# EAGLE design I2C-23017 (EAGLE 7.7.0)

## Sheet 1 of 2
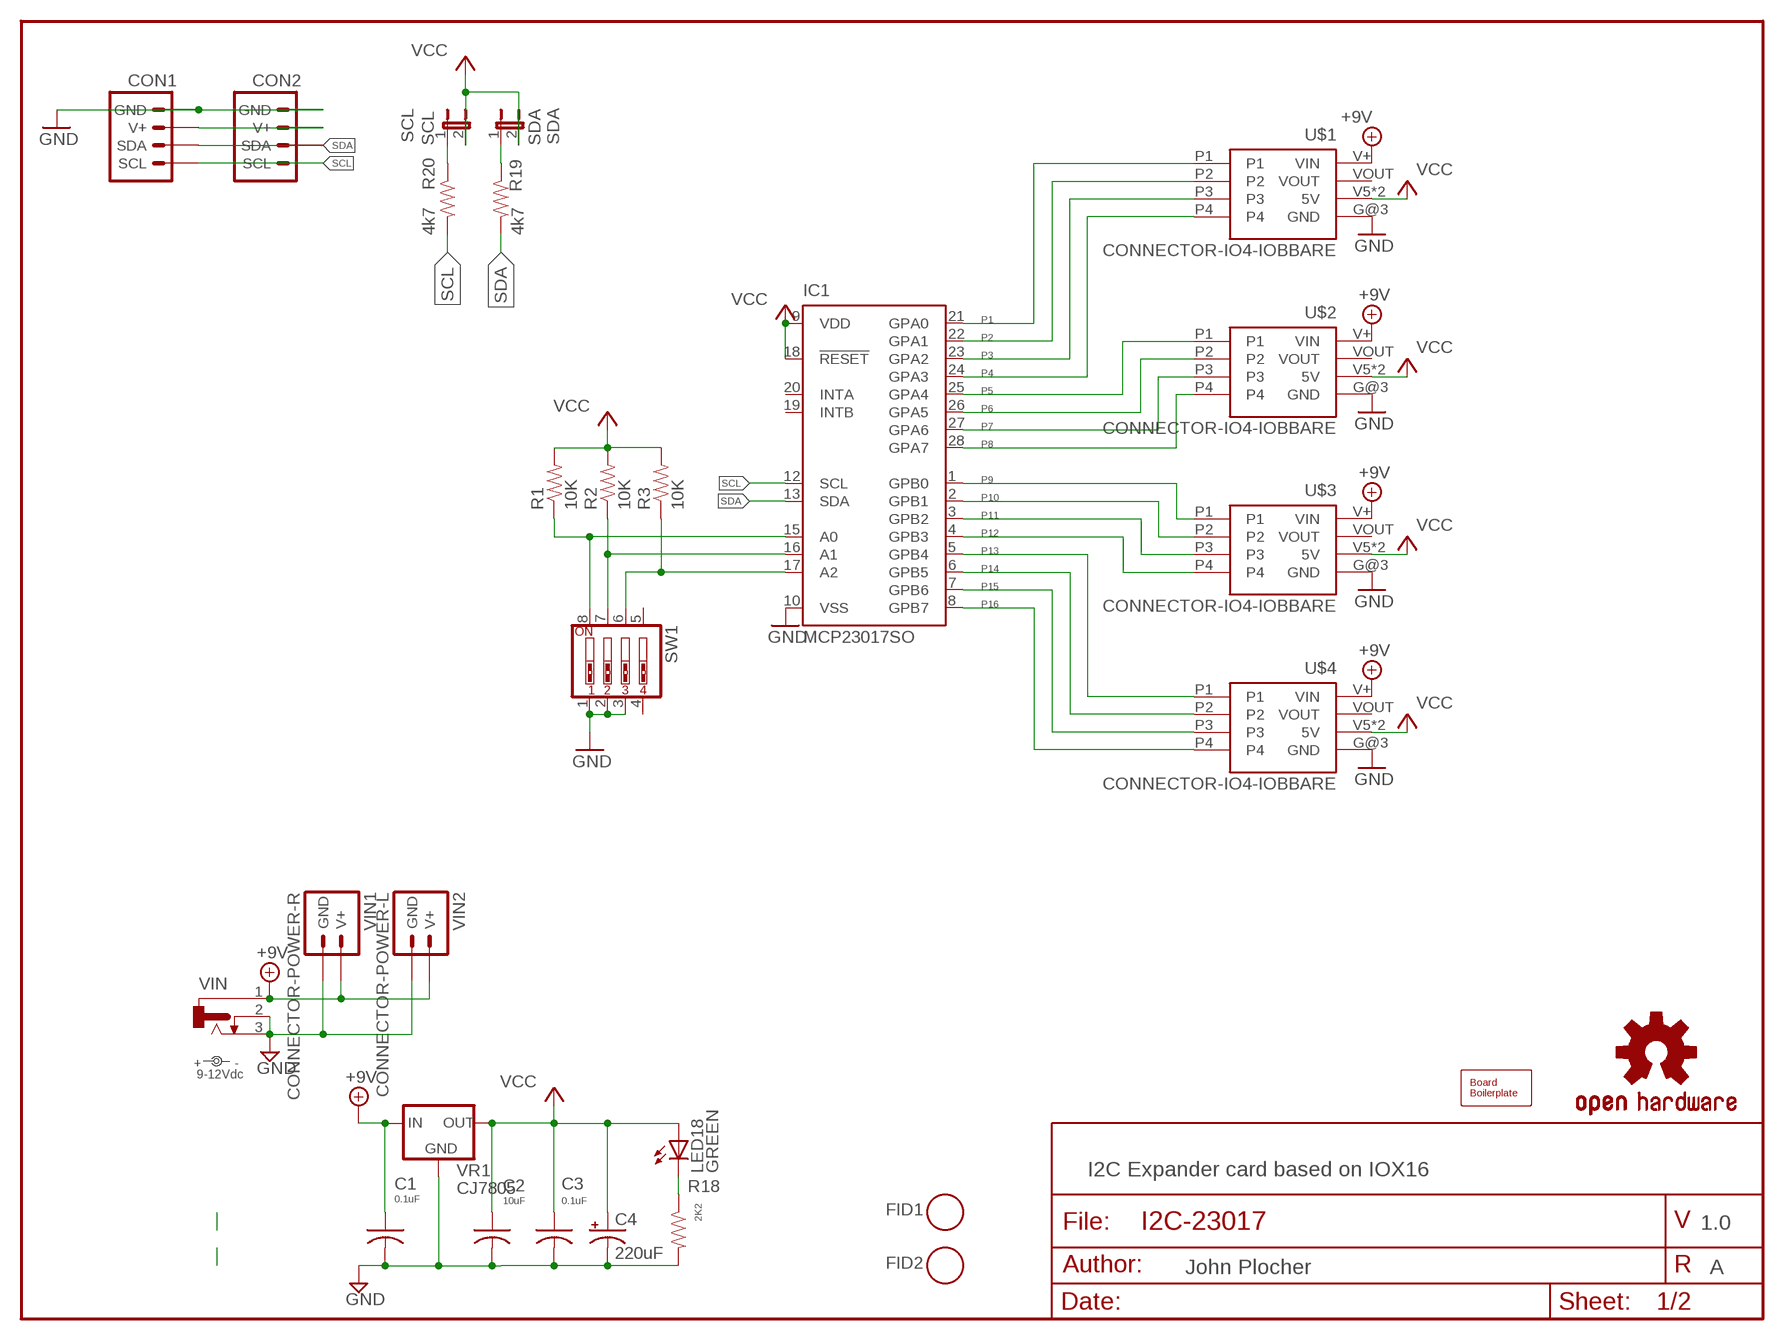
[diagram p0: schematic, sheet 1]

### Parts
BOARD1  BOARD80X100-IOB  [BOARD-DINRAIL-3.17IN-IOB]
C1  0.1uF  CAP0805  [0805-CAP]
C2  10uF  CAP0805  [0805-CAP]
C3  0.1uF  CAP0805  [0805-CAP]
C4  220uF  CAP-POL0810  [0810-CAP]
CON1  CONNECTOR-I2CLEFT  [I2C-L]
CON2  CONNECTOR-I2CLEFT  [I2C-L]
FID1  FIDUCIAL  [FIDUCIAL_1MM]
FID2  FIDUCIAL  [FIDUCIAL_1MM]
IC1  MCP23017SO  [SO28W]
LED18  GREEN  LED0603-LED  [0603-LED]
OSHW1  DOC-OSHW-LOGO-M  [OSHW-LOGO-M]
POWER  9-12Vdc  DOC-POWER_LABEL  [PWR_LABEL]
R1  10K  R0603-RES  [0603-RES]
R2  10K  R0603-RES  [0603-RES]
R3  10K  R0603-RES  [0603-RES]
R18  2K2  R0603-RES  [0603-RES]
R19  4k7  R0603-RES  [0603-RES]
R20  4k7  R0603-RES  [0603-RES]
SCL  SCL  JUMPER-2PTH_LOCK  [1X02_LOCK]
SDA  SDA  JUMPER-2PTH_LOCK  [1X02_LOCK]
SW1  SW_DIP-4  [EDG-04]
U$1  CONNECTOR-IO4-IOBBARE  [IO4-IOB]
U$2  CONNECTOR-IO4-IOBBARE  [IO4-IOB]
U$3  CONNECTOR-IO4-IOBBARE  [IO4-IOB]
U$4  CONNECTOR-IO4-IOBBARE  [IO4-IOB]
VIN  CONNECTOR-DC-POWER-RA  [DCJ0202]
VIN1  CONNECTOR-POWER-R  [POWER-R]
VIN2  CONNECTOR-POWER-L  [POWER-R2]
VR1  CJ7805  VREG-DPAK-5  [TO-252]

### Nets
+9V: C1.1 U$1.V+(VIN) U$2.V+(VIN) U$3.V+(VIN) U$4.V+(VIN) VIN1.V+ VIN1.V+@1(V+) VIN1.V+@2(V+) VIN1.V+@3(V+) VIN2.V+ VIN2.V+@1(V+) VIN2.V+@2(V+) VIN2.V+@3(V+) VIN.1 VR1.1(IN)
A0: IC1.15(A0) R1.1 SW1.8
A1: IC1.16(A1) R2.1 SW1.7
A3: IC1.17(A2) R3.1 SW1.6
GND: C1.2 C2.2 C3.2 C4.- CON1.GND CON1.GND@1(GND) CON2.GND CON2.GND@1(GND) IC1.10(VSS) R18.2 SW1.1 SW1.2 SW1.3 U$1.G@3(GND) U$2.G@3(GND) U$3.G@3(GND) U$4.G@3(GND) VIN1.GND VIN1.GND@1(GND) VIN1.GND@2(GND) VIN1.GND@3(GND) VIN2.GND VIN2.GND@1(GND) VIN2.GND@2(GND) VIN2.GND@3(GND) VIN.2 VIN.3 VR1.2(GND) ; also sheet 2
N$2: CON1.V+ CON1.V+@1(V+) CON2.V+ CON2.V+@1(V+)
N$20 [signals]: R20.1 SCL.1
N$21 [signals]: R19.1 SDA.1
N$22: LED18.C R18.1
P1 [signals]: IC1.21(GPA0) U$1.P1 ; also sheet 2
P2 [signals]: IC1.22(GPA1) U$1.P2 ; also sheet 2
P3 [signals]: IC1.23(GPA2) U$1.P3 ; also sheet 2
P4 [signals]: IC1.24(GPA3) U$1.P4 ; also sheet 2
P5: IC1.25(GPA4) U$2.P1 ; also sheet 2
P6: IC1.26(GPA5) U$2.P2 ; also sheet 2
P7: IC1.27(GPA6) U$2.P3 ; also sheet 2
P8: IC1.28(GPA7) U$2.P4 ; also sheet 2
P9 [signals]: IC1.1(GPB0) U$3.P1 ; also sheet 2
P10 [signals]: IC1.2(GPB1) U$3.P2 ; also sheet 2
P11 [signals]: IC1.3(GPB2) U$3.P3 ; also sheet 2
P12 [signals]: IC1.4(GPB3) U$3.P4 ; also sheet 2
P13 [signals]: IC1.5(GPB4) U$4.P1 ; also sheet 2
P14 [signals]: IC1.6(GPB5) U$4.P2 ; also sheet 2
P15 [signals]: IC1.7(GPB6) U$4.P3 ; also sheet 2
P16 [signals]: IC1.8(GPB7) U$4.P4 ; also sheet 2
SCL [signals]: CON1.SCL CON1.SCL@1(SCL) CON2.SCL CON2.SCL@1(SCL) IC1.12(SCL) R20.2
SDA [signals]: CON1.SDA CON1.SDA@1(SDA) CON2.SDA CON2.SDA@1(SDA) IC1.13(SDA) R19.2
VCC [Power]: C2.1 C3.1 C4.+ IC1.9(VDD) IC1.18(!RESET) LED18.A R1.2 R2.2 R3.2 SCL.2 SDA.2 U$1.V5(5V) U$1.V5@1(5V) U$2.V5(5V) U$2.V5@1(5V) U$3.V5(5V) U$3.V5@1(5V) U$4.V5(5V) U$4.V5@1(5V) VR1.3(OUT) ; also sheet 2
Unconnected: IC1.19(INTB) IC1.20(INTA) SW1.4 SW1.5 U$1.VOUT U$2.VOUT U$3.VOUT U$4.VOUT

### Notes on the sheet
- I2C Expander card based on IOX16
- 1.0
- John Plocher | A

## Sheet 2 of 2
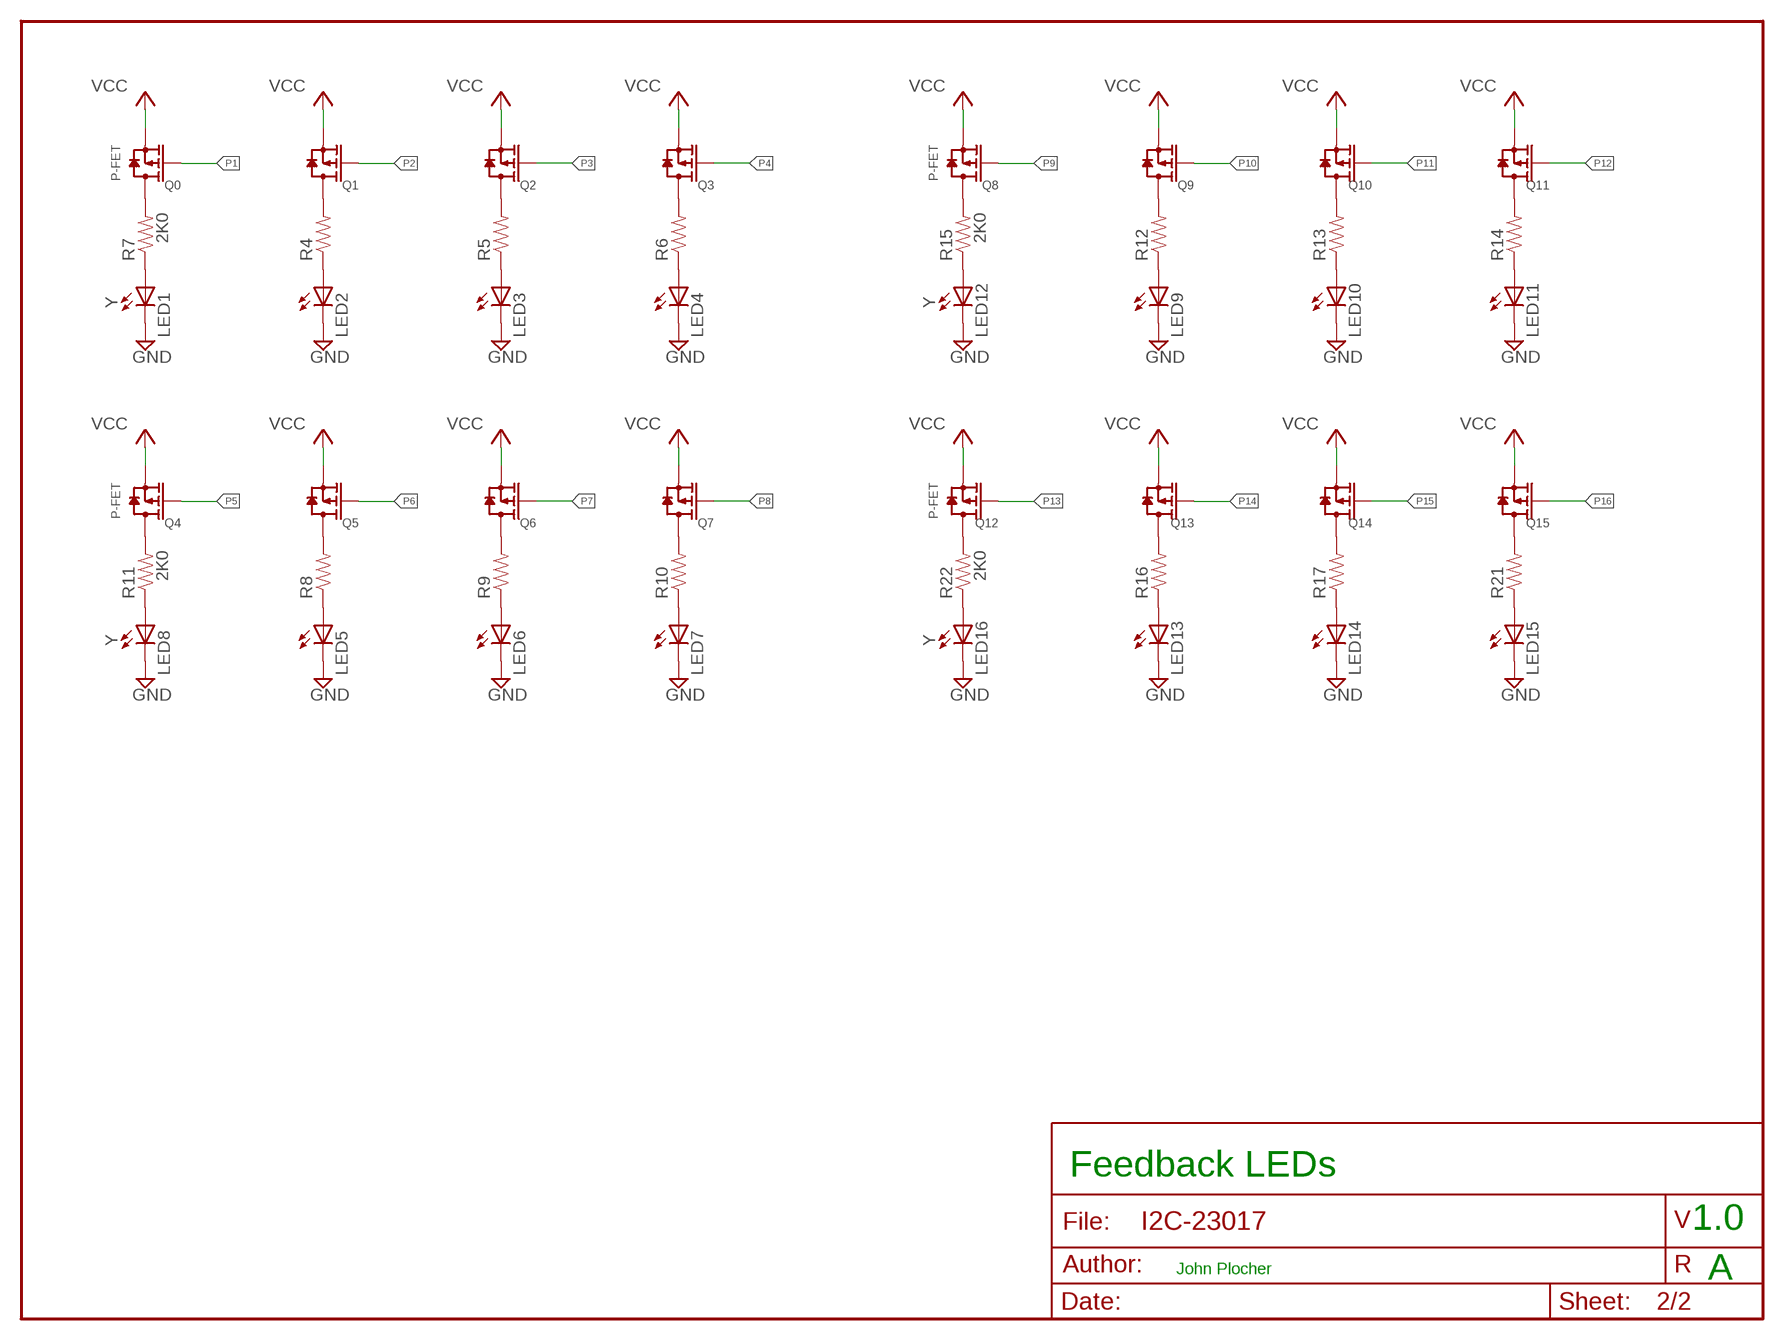
[diagram p1: schematic, sheet 2]

### Parts
LED1  Y  LED0603-LED  [0603-LED]
LED2  Y  LED0603-LED  [0603-LED]
LED3  Y  LED0603-LED  [0603-LED]
LED4  Y  LED0603-LED  [0603-LED]
LED5  Y  LED0603-LED  [0603-LED]
LED6  Y  LED0603-LED  [0603-LED]
LED7  Y  LED0603-LED  [0603-LED]
LED8  Y  LED0603-LED  [0603-LED]
LED9  Y  LED0603-LED  [0603-LED]
LED10  Y  LED0603-LED  [0603-LED]
LED11  Y  LED0603-LED  [0603-LED]
LED12  Y  LED0603-LED  [0603-LED]
LED13  Y  LED0603-LED  [0603-LED]
LED14  Y  LED0603-LED  [0603-LED]
LED15  Y  LED0603-LED  [0603-LED]
LED16  Y  LED0603-LED  [0603-LED]
Q0  P-FET  MOSFET-P-044021001  [SOT23]
Q1  P-FET  MOSFET-P-044021001  [SOT23]
Q2  P-FET  MOSFET-P-044021001  [SOT23]
Q3  P-FET  MOSFET-P-044021001  [SOT23]
Q4  P-FET  MOSFET-P-044021001  [SOT23]
Q5  P-FET  MOSFET-P-044021001  [SOT23]
Q6  P-FET  MOSFET-P-044021001  [SOT23]
Q7  P-FET  MOSFET-P-044021001  [SOT23]
Q8  P-FET  MOSFET-P-044021001  [SOT23]
Q9  P-FET  MOSFET-P-044021001  [SOT23]
Q10  P-FET  MOSFET-P-044021001  [SOT23]
Q11  P-FET  MOSFET-P-044021001  [SOT23]
Q12  P-FET  MOSFET-P-044021001  [SOT23]
Q13  P-FET  MOSFET-P-044021001  [SOT23]
Q14  P-FET  MOSFET-P-044021001  [SOT23]
Q15  P-FET  MOSFET-P-044021001  [SOT23]
R4  2K0  R0805-RES  [0805-RES]
R5  2K0  R0805-RES  [0805-RES]
R6  2K0  R0805-RES  [0805-RES]
R7  2K0  R0805-RES  [0805-RES]
R8  2K0  R0805-RES  [0805-RES]
R9  2K0  R0805-RES  [0805-RES]
R10  2K0  R0805-RES  [0805-RES]
R11  2K0  R0805-RES  [0805-RES]
R12  2K0  R0805-RES  [0805-RES]
R13  2K0  R0805-RES  [0805-RES]
R14  2K0  R0805-RES  [0805-RES]
R15  2K0  R0805-RES  [0805-RES]
R16  2K0  R0805-RES  [0805-RES]
R17  2K0  R0805-RES  [0805-RES]
R21  2K0  R0805-RES  [0805-RES]
R22  2K0  R0805-RES  [0805-RES]

### Nets
GND: LED1.C LED2.C LED3.C LED4.C LED5.C LED6.C LED7.C LED8.C LED9.C LED10.C LED11.C LED12.C LED13.C LED14.C LED15.C LED16.C ; also sheet 1
N$1: Q4.3(D) R11.2
N$3: Q5.3(D) R8.2
N$4: Q6.3(D) R9.2
N$5: Q7.3(D) R10.2
N$6: LED8.A R11.1
N$7: LED5.A R8.1
N$8: LED6.A R9.1
N$9: LED7.A R10.1
N$10: Q8.3(D) R15.2
N$11: Q9.3(D) R12.2
N$12: Q10.3(D) R13.2
N$13: Q11.3(D) R14.2
N$14: LED12.A R15.1
N$15: LED9.A R12.1
N$23: LED10.A R13.1
N$24: LED11.A R14.1
N$28: Q12.3(D) R22.2
N$29: Q13.3(D) R16.2
N$30: Q14.3(D) R17.2
N$31: Q15.3(D) R21.2
N$32: LED16.A R22.1
N$33: LED13.A R16.1
N$34: LED14.A R17.1
N$35: LED15.A R21.1
N$44: Q0.3(D) R7.2
N$45: Q1.3(D) R4.2
N$46: Q2.3(D) R5.2
N$47: Q3.3(D) R6.2
N$48: LED1.A R7.1
N$49: LED2.A R4.1
N$50: LED3.A R5.1
N$51: LED4.A R6.1
P1 [signals]: Q0.1(G) ; also sheet 1
P2 [signals]: Q1.1(G) ; also sheet 1
P3 [signals]: Q2.1(G) ; also sheet 1
P4 [signals]: Q3.1(G) ; also sheet 1
P5: Q4.1(G) ; also sheet 1
P6: Q5.1(G) ; also sheet 1
P7: Q6.1(G) ; also sheet 1
P8: Q7.1(G) ; also sheet 1
P9 [signals]: Q8.1(G) ; also sheet 1
P10 [signals]: Q9.1(G) ; also sheet 1
P11 [signals]: Q10.1(G) ; also sheet 1
P12 [signals]: Q11.1(G) ; also sheet 1
P13 [signals]: Q12.1(G) ; also sheet 1
P14 [signals]: Q13.1(G) ; also sheet 1
P15 [signals]: Q14.1(G) ; also sheet 1
P16 [signals]: Q15.1(G) ; also sheet 1
VCC [Power]: Q0.2(S) Q1.2(S) Q2.2(S) Q3.2(S) Q4.2(S) Q5.2(S) Q6.2(S) Q7.2(S) Q8.2(S) Q9.2(S) Q10.2(S) Q11.2(S) Q12.2(S) Q13.2(S) Q14.2(S) Q15.2(S) ; also sheet 1

### Notes on the sheet
- Feedback LEDs
- 1.0
- John Plocher
- A

## Library data of the parts
BOARD1 = SPCoast:BOARD
C1-C3 = SPCoast:CAP*
C4 = SPCoast:CAP-POL*
CON1 CON2 = SPCoast:CONNECTOR-I2C
FID1 FID2 = SPCoast:FIDUCIAL: For use by pick and place machines to calibrate the vision/machine, 1mm By microbuilder.eu
IC1 = microchip:MCP23017: http://ww1.microchip.com/downloads/en/DeviceDoc/21952a.pdf Source: http://ww1.microchip.com/downloads/en/DeviceDoc/21952a.pdf; MF: MICROCHIP; MPN: MCP23017-E/SO; OC_FARNELL: 1332087; OC_NEWARK: 31K2958
LED1-LED16 LED18 = SPCoast:LED*
OSHW1 = SPCoast:DOC-OSHW-LOGO-: Open Source Hardware Logo This logo indicates the piece of hardware it is found on incorporates a OSHW license and/or adheres to the definition of open source hardware http://freedomdefined.org/OSHW Creative Commons - Attribution - ShareAlike 3.0
POWER = SPCoast:DOC-POWER_LABEL
Q0 Q1-Q15 = SPCoast:MOSFET-P: CJ2305：SMD MOSFET P-CH 8V-4.1A
R1-R22 = SPCoast:R*: Resistor Basic schematic elements and footprints for 0603, 1206, and PTH 1/10th watt (small) resistors.
SCL SDA = SPCoast:JUMPER-2: Jumper Basic 0.1" spaced jumper. Use with breakaway headers.
SW1 = SPCoast:SW_DIP-4: DIP SWITCH
U$1-U$4 = SPCoast:CONNECTOR-IO4-IOB
VIN = SPCoast:CONNECTOR-DC-POWER: DC POWER JACK
VIN1 VIN2 = SPCoast:CONNECTOR-POWER
VR1 = SPCoast:VREG-?-*: Voltage Regulator Standard linear regulator. 7805 uses IGO pinout LM1117 uses GOI pinout

## Net classes
0 default: width 0.254 mm, drill 0.4 mm, clearance 0.127 mm
1 Power: width 0.254 mm, drill 0.4 mm, clearance 0.127 mm
2 signals: width 0.254 mm, drill 0.4 mm, clearance 0.127 mm

## Board
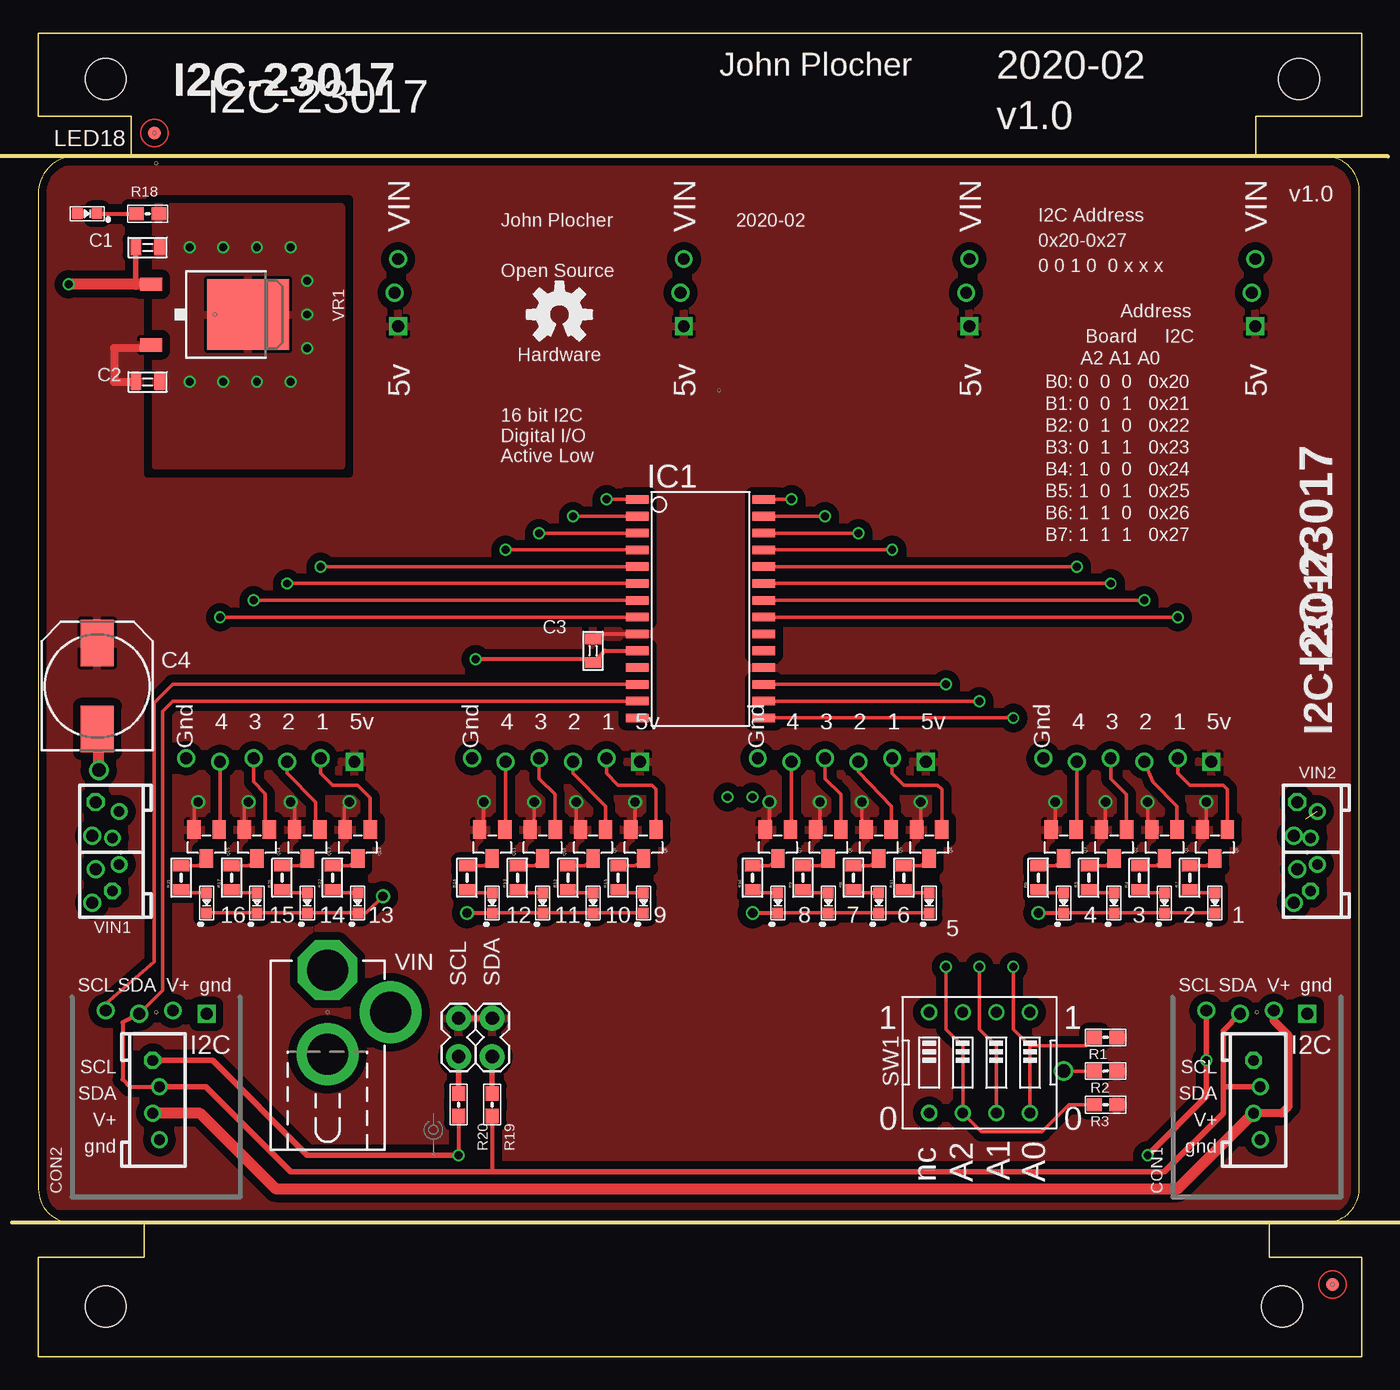
[diagram p2: board, top side]
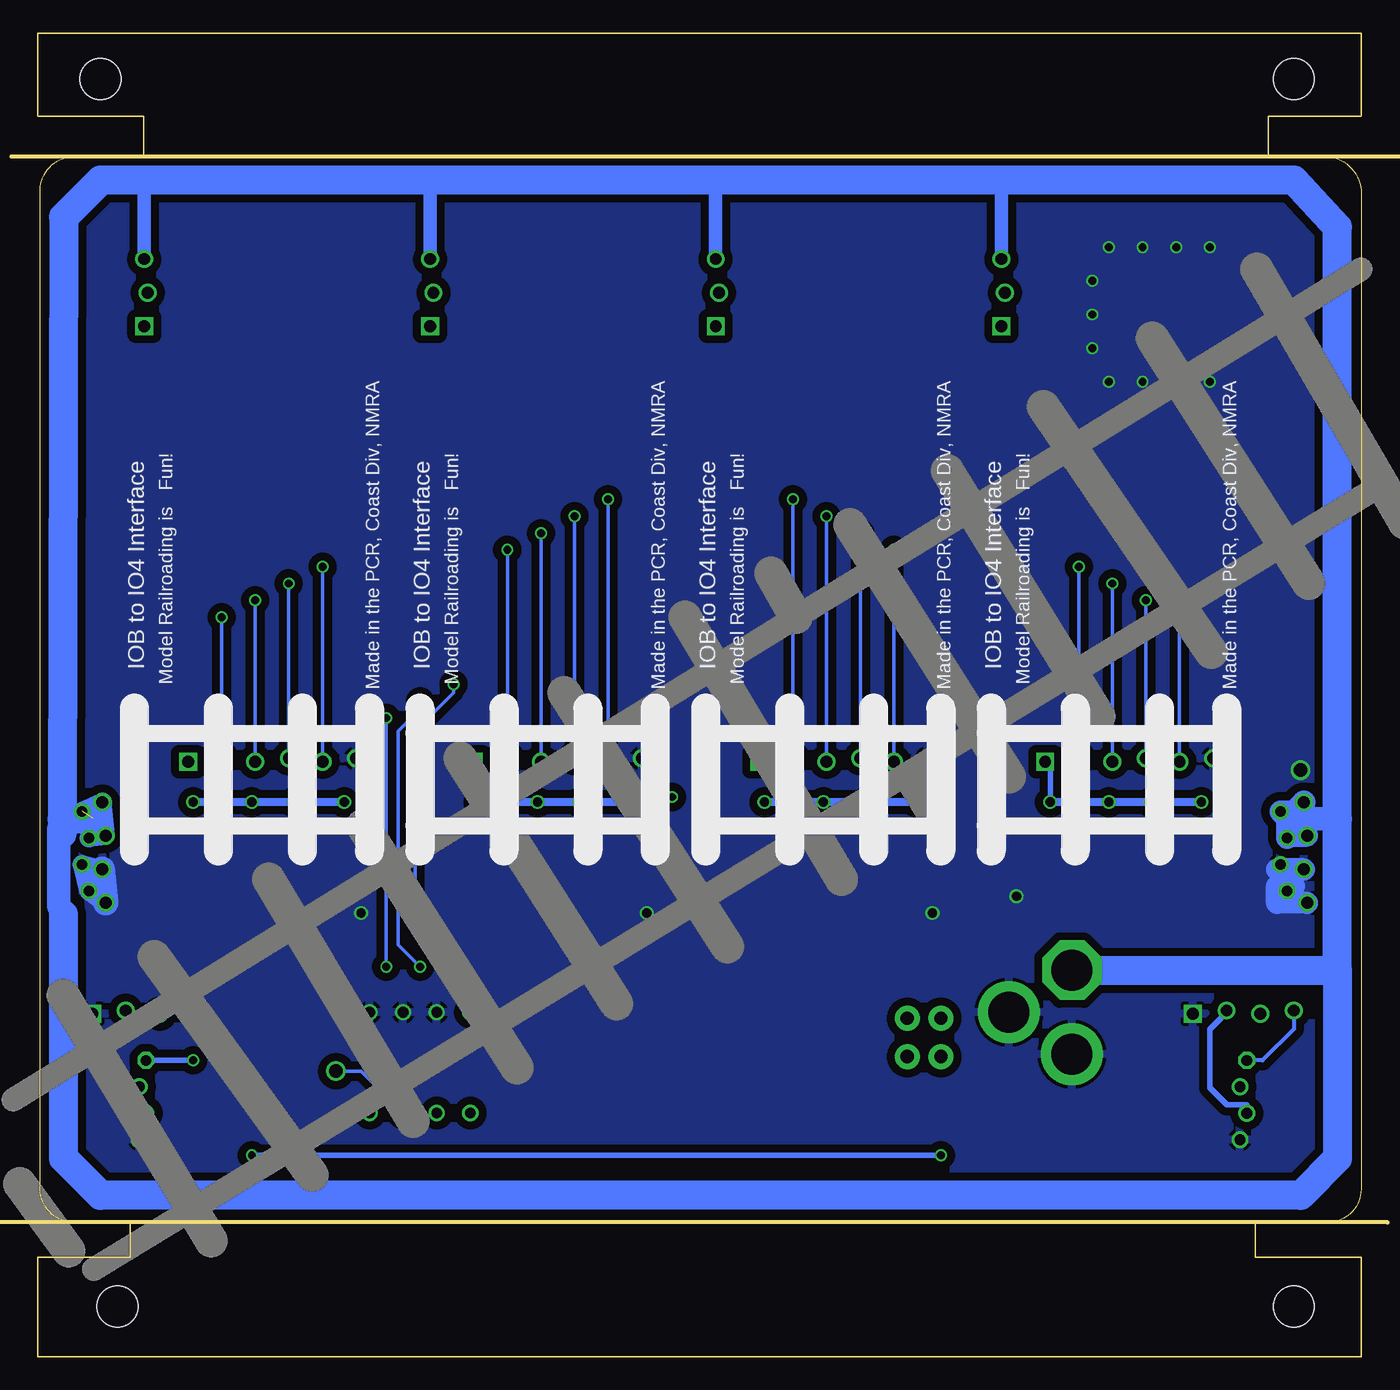
[diagram p3: board, bottom side, seen from below]

Size 100.01 x 100 mm. Coordinates in mm from the lower left corner, seen from the top.
Copper layers (1*16): Top 0.035mm / dielectric 1.5mm / Bottom 0.035mm
Design rules "default *": minimum track width 5mil, minimum drill 0.2mm, track to track 5mil, track to pad 5mil, pad to pad 5mil, via to via 5mil, smd to smd 5mil, copper to edge 0.4mm, drill to drill 5mil, minimum pad ring 3mil, minimum via ring 3mil, stop-mask expansion 4mil, vias tented up to drill 0mil, thermal gap 10mil

### Footprints (pad centres in the part's own frame; a part is rotated, then mirrored left to right if it is on the bottom)
BOARD-DINRAIL-3.17IN-IOB = hole 3.1: 5.08,96.52; 95.25,96.52; 5.08,3.81; 93.98,3.81
0805-CAP = smd 0.8 x 1.2: 1 -0.9,0; 2 0.9,0
0810-CAP = smd 3.5 x 2.5: + 3.25,0; - -3.25,0
I2C-L = drill 0.9 square: GND 3.81,-0.127 | drill 0.8 pad 1.27: GND@1 0.254,-9.635; SDA@1 0.254,-5.635; V+@1 -0.254,-7.635 | drill 0.9: SCL -3.81,0.127; SDA -1.27,-0.127; V+ 1.27,0.127 | drill 0.8 pad 1.27 octagon: SCL@1 -0.254,-3.635
FIDUCIAL_1MM = smd 1 x 1: 1 0,0
SO28W = smd 0.65 x 1.7: 1 -7.62,-4.78; 2 -6.35,-4.78; 3 -5.08,-4.78; 4 -3.81,-4.78; 5 -2.54,-4.78; 6 -1.27,-4.78; 7 0,-4.78; 8 1.27,-4.78; 9 2.54,-4.78; 10 3.81,-4.78; 11 5.08,-4.78; 12 6.35,-4.78; 13 7.62,-4.78; 14 8.89,-4.78; 15 8.89,4.78; 16 7.62,4.78; 17 6.35,4.78; 18 5.08,4.78; 19 3.81,4.78; 20 2.54,4.78; 21 1.27,4.78; 22 0,4.78; 23 -1.27,4.78; 24 -2.54,4.78; 25 -3.81,4.78; 26 -5.08,4.78; 27 -6.35,4.78; 28 -7.62,4.78
0603-LED = smd 0.8 x 0.8: A -0.75,0; C 0.75,0
SOT23 = smd 1 x 1.4: 1 -0.95,-1.1; 2 0.95,-1.1; 3 0,1.1
0603-RES = smd 1.1 x 1: 1 -0.85,0; 2 0.85,0
0805-RES = smd 0.8 x 1.2: 1 -0.9,0; 2 0.9,0
1X02_LOCK = drill 1.016 pad 1.88: 1 -0.178,0; 2 2.718,0
EDG-04 = drill 0.813: 1 -3.81,-3.81; 2 -1.27,-3.81; 3 1.27,-3.81; 4 3.81,-3.81; 5 3.81,3.81; 6 1.27,3.81; 7 -1.27,3.81; 8 -3.81,3.81
IO4-IOB = drill 0.9: G@3 44.958,2.286; P1 44.958,12.446; P2 45.212,9.906; P3 44.958,7.366; P4 45.212,4.826; V+ 7.239,18.288; VOUT 9.779,18.034 | drill 0.9 square: V5 12.319,18.288; V5@1 45.212,14.986
DCJ0202 = drill 3.1 pad 4.5 octagon: 1 0,3.175 | drill 3.1 pad 4.7: 2 4.763,0; 3 0,-3.175
POWER-R = drill 0.9: GND -2.032,-1.27; GND@1 -2.286,-3.81; V+ -2.286,1.27 | drill 0.8 pad 1.27: GND@2 -0.254,-0.904; V+@2 -0.254,3.096; V+@3 -0.762,1.096 | drill 0.8 pad 1.27 octagon: GND@3 -0.762,-2.904 | drill 0.9 octagon: V+@1 -2.032,3.81
POWER-R2 = drill 0.9: GND -0.762,-1.27; GND@1 -1.016,-3.81; V+ -1.016,1.27 | drill 0.8 pad 1.27: GND@2 0.762,-0.904; V+@2 0.762,3.096; V+@3 0.254,1.096 | drill 0.8 pad 1.27 octagon: GND@3 0.254,-2.904 | drill 0.9 octagon: V+@1 -0.762,3.81
TO-252 = smd 1.016 x 1.651: 1 -2.286,-4.826; 3 2.286,-4.826 | smd 5.3 x 6.2: 2 0,2.5

### Placement (x,y rotation side)
BOARD1  0.01,0 0 top
C1  8.27,83.82 0 top
C2  8.27,73.66 0 top
C3  41.92,53.34 270 top
C4  4.46,50.67 90 top
CON1  92.09,26.04 0 top
CON2  8.9,26.04 0 top
FID1  8.78,92.46 0 top
FID2  97.8,5.46 0 top
IC1  50.05,57.15 270 top
LED1  88.91,34.29 270 top
LED2  85.1,34.29 270 top
LED3  81.29,34.29 270 top
LED4  77.48,34.29 270 top
LED5  63.51,34.29 270 top
LED6  59.7,34.29 270 top
LED7  55.89,34.29 270 top
LED8  67.32,34.29 270 top
LED9  41.92,34.29 270 top
LED10  38.11,34.29 270 top
LED11  34.3,34.29 270 top
LED12  45.73,34.29 270 top
LED13  20.33,34.29 270 top
LED14  16.52,34.29 270 top
LED15  12.71,34.29 270 top
LED16  24.14,34.29 270 top
LED18  3.7,86.36 0 top
OSHW1  39.38,78.74 0 top
POWER  29.86,17.14 0 top
Q0  88.91,38.73 180 top
Q1  85.1,38.73 180 top
Q2  81.29,38.73 180 top
Q3  77.48,38.73 180 top
Q4  67.32,38.73 180 top
Q5  63.51,38.73 180 top
Q6  59.7,38.73 180 top
Q7  55.89,38.73 180 top
Q8  45.73,38.73 180 top
Q9  41.92,38.73 180 top
Q10  38.11,38.73 180 top
Q11  34.3,38.73 180 top
Q12  24.14,38.73 180 top
Q13  20.33,38.73 180 top
Q14  16.52,38.73 180 top
Q15  12.71,38.73 180 top
R1  80.66,24.13 0 top
R2  80.66,21.59 0 top
R3  80.66,19.05 0 top
R4  83.2,36.2 90 top
R5  79.39,36.2 90 top
R6  75.58,36.2 90 top
R7  87.01,36.2 90 top
R8  61.61,36.2 90 top
R9  57.8,36.2 90 top
R10  53.99,36.2 90 top
R11  65.42,36.2 90 top
R12  40.02,36.2 90 top
R13  36.21,36.2 90 top
R14  32.4,36.2 90 top
R15  43.83,36.2 90 top
R16  18.43,36.2 90 top
R17  14.62,36.2 90 top
R18  8.27,86.36 0 top
R19  34.3,19.05 270 top
R20  31.76,19.05 270 top
R21  10.81,36.2 90 top
R22  22.24,36.2 90 top
SCL  31.76,22.86 90 top
SDA  34.3,22.86 90 top
SW1  71.13,22.23 180 top
U$1  73.67,90.17 270 top
U$2  52.08,90.17 270 top
U$3  30.49,90.17 270 top
U$4  8.9,90.17 270 top
VIN  21.86,26.04 0 top
VIN1  6.36,38.1 0 top
VIN2  95.9,38.1 0 top
VR1  13.35,78.74 270 top

### Tracks (layer width: path | path; a pad name or v marks a point on that pad's centre or on a via)
+9V  (via drill 0.6)  (1 unrouted)
  Top 0.406: C1.1 7.37,81.03 7.38,81.03
  Top 0.813: VR1.1 7.38,81.03 v2.3,81.03
  Bottom 0.813: v2.3,81.03 1.79,81.03
  Bottom 1.016: U$4.V+ 27.19,88.9 | U$3.V+ 48.78,88.9 | U$2.V+ 70.37,88.9 | U$1.V+ 91.96,88.9
  Bottom 1.422: VIN2.V+@2 VIN2.V+@1 VIN2.V+ VIN2.V+@3
  Bottom 1.676: VIN1.V+@1 5.05,41.2 VIN1.V+@2 5.6,40.69 VIN1.V+@3 5.43,39.37 VIN1.V+ | 98.18,39.2 98.18,39.5
  Bottom 1.778: 98.06,33.4 98.44,34.04 98.44,39.88 98.18,39.5 | VIN1.V+@1 5.09,41.15 5.09,40.64 1.79,40.64
  Bottom 2.184: 1.79,29.21 1.79,40.64 1.79,81.03 1.79,85.34 5.09,88.9 27.19,88.9 48.78,88.9 70.37,88.9 91.96,88.9 95.26,88.9 98.06,86.11 98.18,40.64 | 98.18,40.64 98.18,39.88 98.18,39.5 | 1.79,29.21 1.79,14.99 4.59,12.19 95.26,12.19 98.06,14.99 98.06,33.4 | VIN.1 1.79,29.21 | 98.18,40.64 95.77,40.64
A0  (via drill 0.6)
  Top 0.254: IC1.15 v73.67,48.26 | 74.94,23.5 SW1.8 | v73.67,29.46 73.67,24.77 74.94,23.5 | R1.1 79.17,23.5 74.94,23.5
  Bottom 0.254: v73.67,48.26 v73.67,29.46
A1  (via drill 0.6, 1)
  Top 0.254: IC1.16 v71.13,49.53 | v71.13,29.46 71.13,24.77 72.4,23.5 SW1.7 | R2.1 v77.48,21.59
  Bottom 0.254: v71.13,49.53 71.13,48.9 72.78,47.24 72.78,31.11 v71.13,29.46 | v77.48,21.59 75.58,21.59 SW1.7
A2  (via drill 0.6)
  other vias: 52.08,42.29
A3  (via drill 0.6)
  Top 0.254: IC1.17 v68.59,50.8 | v68.59,29.46 68.59,24.77 69.86,23.5 SW1.6 71.26,17.02 75.83,17.02 77.86,19.05 R3.1
  Bottom 0.254: v68.59,50.8 68.59,50.16 71.51,47.24 71.51,32.38 v68.59,29.46
A4  (via drill 0.6)
  other vias: 53.99,42.29
GND  (via drill 0.6, 0.7, 1)
  Top 0.254: LED4.C LED3.C LED2.C LED1.C | LED7.C LED6.C LED5.C LED8.C | LED11.C LED10.C LED9.C LED12.C | LED15.C LED14.C LED13.C LED16.C 24.79,33.54 v26.05,34.8
  Top 0.305: LED4.C 77.48,33.53 v75.58,33.53 | LED7.C 55.89,33.53 v53.99,33.53 | LED11.C 34.3,33.53 v32.4,33.53 | LED15.C 12.71,33.53 | IC1.10 42.82,53.34 C3.2 41.66,52.7 v33.03,52.7
  Top 0.813: C4.- v4.59,44.32
  Bottom 1.422: VIN2.GND VIN2.GND@2 96.15,35.18 | VIN2.GND@3 VIN2.GND@1
  Bottom 1.676: VIN1.GND 6.36,36.83 | VIN1.GND@1 6.36,34.29 6.36,35.56 5.09,35.56
  Bottom 1.93: VIN2.GND VIN2.GND@1
  other vias: 11.44,83.82 13.98,83.82 16.52,83.82 19.06,83.82 20.33,81.28 20.33,78.74 20.33,76.2 19.06,73.66 16.52,73.66 13.98,73.66 11.44,73.66
  pour Bottom (isolate 0.61): 0.01,89.79 0.01,11.18 100.34,11.18 100.34,89.79
  pour Top (isolate 0.61): 22.87,86.87 22.87,67.31 8.9,67.31 8.9,86.87
N$1
  Top 0.254: Q4.3 66.7,37.09 R11.2
N$2
  Top 0.61: CON1.V+@1 93.98,18.4 94.5,18.92 94.5,24.26 93.36,25.4 CON1.V+
  Top 0.813: CON2.V+@1 12.22,18.4 17.92,12.7 86.13,12.7 CON1.V+@1
  Bottom 0.406: CON2.V+@1 8.66,19.05 10.17,19.05 11.44,20.32 11.44,24.77 10.17,26.04 CON2.V+
N$3
  Top 0.254: Q5.3 62.89,37.09 R8.2
N$4
  Top 0.254: Q6.3 59.08,37.09 R9.2
N$5
  Top 0.254: Q7.3 55.27,37.09 R10.2
N$6
  Top 0.254: R11.1 65.67,35.04 LED8.A
N$7
  Top 0.254: R8.1 61.86,35.04 LED5.A
N$8
  Top 0.254: R9.1 58.05,35.04 LED6.A
N$9
  Top 0.254: R10.1 54.24,35.04 LED7.A
N$10
  Top 0.254: Q8.3 45.11,37.09 R15.2
N$11
  Top 0.254: Q9.3 41.3,37.09 R12.2
N$12
  Top 0.254: Q10.3 37.49,37.09 R13.2
N$13
  Top 0.254: Q11.3 33.68,37.09 R14.2
N$14
  Top 0.254: R15.1 44.08,35.04 LED12.A
N$15
  Top 0.254: R12.1 40.27,35.04 LED9.A
N$20
  Top 0.406: R20.1 SCL.1
N$21
  Top 0.406: R19.1 SDA.1
N$22
  Top 0.305: LED18.C R18.1
N$23
  Top 0.254: R13.1 36.46,35.04 LED10.A
N$24
  Top 0.254: R14.1 32.65,35.04 LED11.A
N$28
  Top 0.254: Q12.3 23.52,37.09 R22.2
N$29
  Top 0.254: Q13.3 19.71,37.09 R16.2
N$30
  Top 0.254: Q14.3 15.9,37.09 R17.2
N$31
  Top 0.254: Q15.3 12.09,37.09 R21.2
N$32
  Top 0.254: R22.1 22.49,35.04 LED16.A
N$33
  Top 0.254: R16.1 18.68,35.04 LED13.A
N$34
  Top 0.254: R17.1 14.87,35.04 LED14.A
N$35
  Top 0.254: R21.1 11.06,35.04 LED15.A
N$44
  Top 0.254: Q0.3 88.29,37.09 R7.2
N$45
  Top 0.254: Q1.3 84.48,37.09 R4.2
N$46
  Top 0.254: Q2.3 80.67,37.09 R5.2
N$47
  Top 0.254: Q3.3 76.86,37.09 R6.2
N$48
  Top 0.254: R7.1 87.26,35.04 LED1.A
N$49
  Top 0.254: R4.1 83.45,35.04 LED2.A
N$50
  Top 0.254: R5.1 79.64,35.04 LED3.A
N$51
  Top 0.254: R6.1 75.83,35.04 LED4.A
P1  (via drill 0.6)
  Top 0.254: IC1.21 v86.12,55.88 | Q0.1 89.86,42.87 89.55,43.18 87.01,43.18 86.12,44.07 U$1.P1
  Bottom 0.254: v86.12,55.88 U$1.P1
P2  (via drill 0.6)
  Top 0.254: Q1.1 86.05,41.59 84.21,43.43 U$1.P2 | IC1.22 v83.58,57.15
  Bottom 0.254: v83.58,57.15 U$1.P2
P3  (via drill 0.6)
  Top 0.254: Q2.1 82.24,42.48 81.04,43.69 U$1.P3 | IC1.23 v81.04,58.42
  Bottom 0.254: v81.04,58.42 U$1.P3
P4  (via drill 0.6)
  Top 0.254: Q3.1 78.75,40.16 78.5,40.41 U$1.P4 | IC1.24 v78.5,59.69
  Bottom 0.254: v78.5,59.69 U$1.P4
P5  (via drill 0.6)
  Top 0.254: IC1.25 v64.53,60.96 | U$2.P1 64.53,44.07 65.42,43.18 67.96,43.18 68.27,42.87 Q4.1
  Bottom 0.254: v64.53,60.96 U$2.P1
P6  (via drill 0.6)
  Top 0.254: Q5.1 64.46,41.59 61.99,44.2 U$2.P2 | IC1.26 v61.99,62.23
  Bottom 0.254: v61.99,62.23 U$2.P2
P7  (via drill 0.6)
  Top 0.254: Q6.1 60.65,42.48 59.45,43.69 U$2.P3 | IC1.27 v59.45,63.5
  Bottom 0.254: v59.45,63.5 U$2.P3
P8  (via drill 0.6)
  Top 0.254: 56.91,40.41 57.16,40.16 Q7.1 56.91,39.9 U$2.P4 | IC1.28 v56.91,64.77
  Bottom 0.254: v56.91,64.77 U$2.P4
P9  (via drill 0.6)
  Top 0.254: v42.94,64.77 IC1.1 | Q8.1 46.68,42.87 46.37,43.18 43.83,43.18 42.94,44.07 U$3.P1
  Bottom 0.254: U$3.P1 v42.94,64.77
P10  (via drill 0.6)
  Top 0.254: Q9.1 42.87,41.59 40.4,44.07 U$3.P2 | v40.4,63.5 IC1.2
  Bottom 0.254: U$3.P2 v40.4,63.5
P11  (via drill 0.6)
  Top 0.254: Q10.1 39.06,42.48 37.86,43.69 U$3.P3 | v37.86,62.23 IC1.3
  Bottom 0.254: U$3.P3 v37.86,62.23
P12  (via drill 0.6)
  Top 0.254: Q11.1 35.57,40.16 35.32,40.41 U$3.P4 | v35.32,60.96 IC1.4
  Bottom 0.254: U$3.P4 v35.32,60.96
P13  (via drill 0.6)
  Top 0.254: v21.35,59.69 IC1.5 | Q12.1 25.09,42.23 24.14,43.18 22.24,43.18 21.35,44.07 U$4.P1
  Bottom 0.254: U$4.P1 v21.35,59.69
P14  (via drill 0.6)
  Top 0.254: v18.81,58.42 IC1.6 | Q13.1 20.97,40.15 20.97,41.91 18.81,44.07 U$4.P2
  Bottom 0.254: U$4.P2 v18.81,58.42
P15  (via drill 0.6)
  Top 0.254: v16.27,57.15 IC1.7 | Q14.1 17.16,40.15 17.16,42.55 16.27,43.43 U$4.P3
  Bottom 0.254: U$4.P3 v16.27,57.15
P16  (via drill 0.6)
  Top 0.254: v13.73,55.88 IC1.8 | Q15.1 13.73,39.9 U$4.P4
  Bottom 0.254: U$4.P4 v13.73,55.88
SCL  (via drill 0.6)
  Top 0.254: IC1.12 10.17,50.8 8.78,49.4 8.78,29.84 5.09,26.67 CON2.SCL
  Top 0.305: R20.2 v31.76,15.24
  Top 0.406: CON2.SCL@1 13.17,22.4 20.33,15.24 v31.76,15.24 | v83.83,15.24 88.28,19.68 v88.28,22.4 CON1.SCL
  Bottom 0.305: CON2.SCL 5.09,24.77 7.46,22.4 CON2.SCL@1
  Bottom 0.406: v31.76,15.24 v83.83,15.24 | CON1.SCL@1 v88.28,22.4
SDA
  Top 0.254: IC1.13 10.17,49.53 9.41,48.77 9.41,27.69 CON2.SDA
  Top 0.305: CON2.SDA 6.36,25.27 6.36,20.95 6.92,20.4 CON2.SDA@1 | 34.09,18.41 34.3,18.41 34.3,13.97
  Top 0.406: CON1.SDA 89.55,24.64 89.55,20.4 | CON2.SDA@1 12.63,20.4 19.06,13.97 34.3,13.97 85.1,13.97 89.55,18.41 89.55,20.4 | CON1.SDA@1 89.55,20.4 | 34.09,18.41 R19.2
VCC  (via drill 0.7)
  Top 0.254: 87.9,40.39 87.96,40.32 87.96,39.69 87.64,39.37 87.64,39.52 Q0.2 88.28,40.15 v88.28,41.91 | 84.21,40.39 84.15,40.33 84.15,39.69 83.83,39.37 83.83,40.16 | 80.4,40.39 80.34,40.33 80.48,40.33 80.66,40.15 | 76.59,40.39 76.53,40.33 76.67,40.33 76.85,40.15 | v76.85,41.91 76.85,40.15 | 76.85,40.15 Q3.2 | v80.66,41.91 80.66,40.15 | 80.66,40.15 Q2.2 | v83.83,41.91 83.83,40.16 | 83.83,40.16 Q1.2 | 66.31,40.39 66.37,40.32 66.37,39.69 66.05,39.37 66.05,39.52 Q4.2 66.69,40.15 v66.69,41.91 | 62.62,40.39 62.56,40.33 Q5.2 62.24,40.16 v62.24,41.91 | 55,40.39 54.94,40.33 55.08,40.33 55.26,40.15 | v55.26,41.91 55.26,40.15 | 55.26,40.15 Q7.2 | v59.07,41.91 59.07,40.15 Q6.2 58.43,39.52 | 44.72,40.39 44.78,40.32 44.46,40 44.46,39.52 | 41.03,40.39 40.97,40.33 Q9.2 40.65,40.16 v40.65,41.91 | 37.22,40.39 37.16,40.33 37.3,40.33 37.48,40.15 | 33.41,40.39 33.35,40.33 33.49,40.33 33.67,40.15 | v33.67,41.91 33.67,40.15 | 33.67,40.15 Q11.2 | v37.48,41.91 37.48,40.15 | 37.48,40.15 Q10.2 | v45.1,41.91 45.1,40.15 Q8.2 44.46,39.52 | 19.44,40.39 19.38,40.33 | 15.63,40.39 15.57,40.33 | 11.82,40.39 11.76,40.33 | 11.76,40.33 11.76,41.59 v12.08,41.91 | v15.89,41.91 15.57,41.59 15.57,40.33 | v19.06,41.91 19.38,41.59 19.38,40.33 | v23.51,41.91 23.13,41.53 23.13,40.39 23.19,40.32 22.87,40 22.87,39.52 | 44.46,39.52 44.46,39.37 | 58.43,39.52 58.43,39.37 | 58.81,40.39 58.43,40.01 58.43,39.52 | Q15.2 11.76,40.33 | Q14.2 15.57,40.33 | Q13.2 19.38,40.33 | Q12.2 22.87,39.52 | 22.87,39.52 22.87,39.37
  Top 0.305: C3.1 42.29,54.61 IC1.9
  Top 0.406: SDA.2 SCL.2
  Top 0.61: VR1.3 8.27,76.2 5.73,76.2 5.73,73.66 C2.1
  Bottom 0.406: U$4.V5@1 23.51,44.96 v23.51,41.91
  Bottom 0.61: v76.85,41.91 v80.66,41.91 v83.83,41.91 v88.28,41.91 | v55.26,41.91 v59.07,41.91 v62.24,41.91 v66.69,41.91 | v33.67,41.91 v37.48,41.91 v40.65,41.91 v45.1,41.91 | v12.08,41.91 v15.89,41.91 v19.06,41.91 v23.51,41.91
  pour Top (isolate 0.61, rank 3): 0.01,89.66 0.01,11.43 99.07,11.43 99.07,89.66

### Text on the board
tPlace: John Plocher | 2020-02 | v1.0 | v1.0 | I2C Address | John Plocher | 2020-02 | 0x20-0x27 | Open Source | 0 0 1 0 0 x x x | Address | Board I2C | Hardware | A2 A1 A0 | B0: 0 0 0 0x20 | B1: 0 0 1 0x21 | B2: 0 1 0 0x22 | 16 bit I2C / Digital I/O / Active Low | B3: 0 1 1 0x23 | B4: 1 0 0 0x24 | B5: 1 0 1 0x25 | B6: 1 1 0 0x26 | B7: 1 1 1 0x27 | 16 | 15 | 14 | 13 | 12 | 11 | 10 | 9 | 8 | 7 | 6 | 4 | 3 | 2 | 1 | 5 | 1 | 1 | 0 | 0 | nc | A2 | A1 | A0
Measures: "
bDocu: Made in the PCR, Coast Division, NMRA | Model Railroading is fun! | 16 bit (4x IO4 ports) / I2C digital I/O | Go Bears! | www. SP Coast .com | Active Low: | A "1" bit in the I/O register is associated with a LOW voltage on a pin